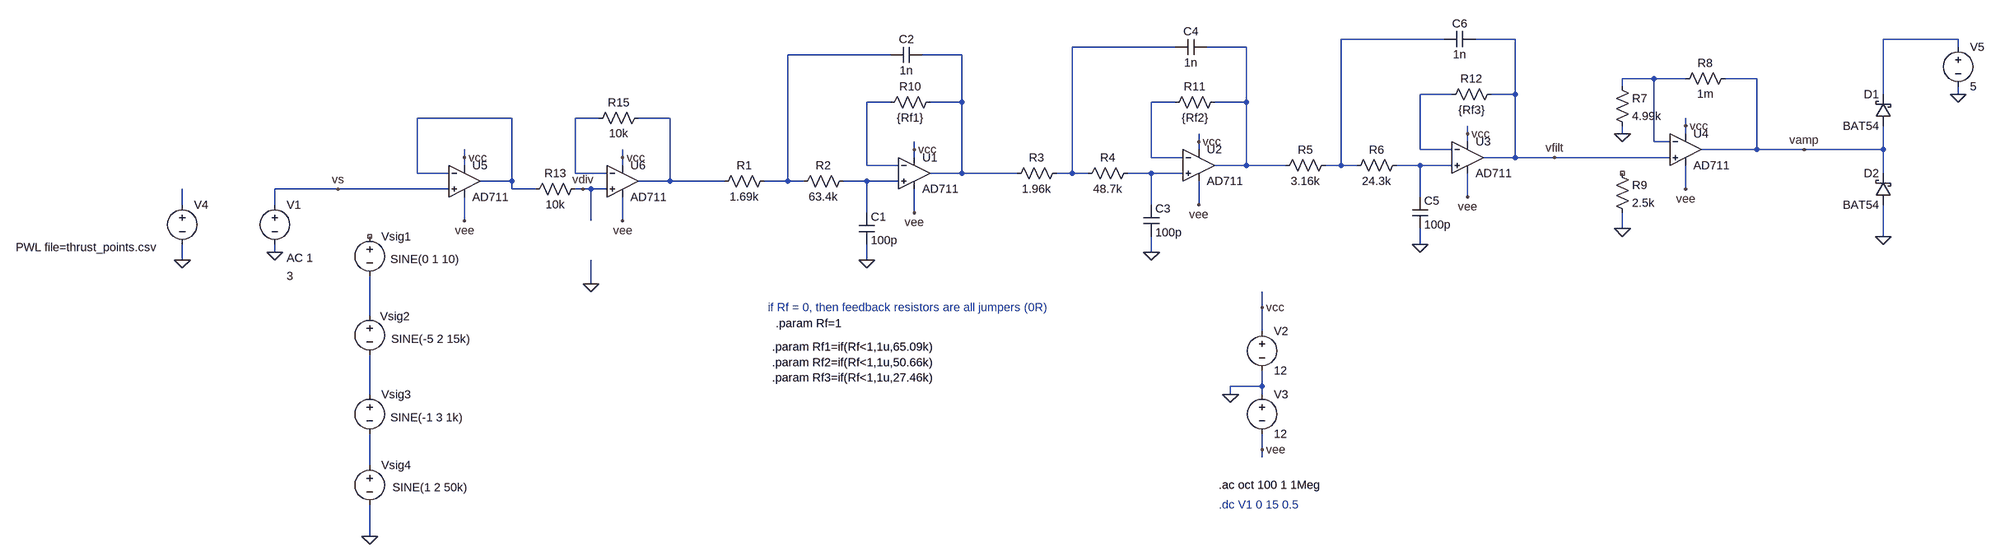
[diagram p0: schematic Anti-Aliasing Filter 30kHz 6th order Bessel.asc]
Anti-Aliasing Filter 30kHz 6th order Bessel.asc, the LTspice schematic file:
Version 4
SHEET 1 3004 744
WIRE 1616 -304 1408 -304
WIRE 1760 -304 1680 -304
WIRE 2912 -304 2752 -304
WIRE 1072 -288 864 -288
WIRE 1216 -288 1136 -288
WIRE 2912 -288 2912 -304
WIRE 496 -272 288 -272
WIRE 640 -272 560 -272
WIRE 2288 -224 2224 -224
WIRE 2352 -224 2288 -224
WIRE 2496 -224 2432 -224
WIRE 2224 -208 2224 -224
WIRE 1632 -192 1568 -192
WIRE 1760 -192 1760 -304
WIRE 1760 -192 1712 -192
WIRE 2752 -192 2752 -304
WIRE 2912 -192 2912 -208
WIRE 496 -176 448 -176
WIRE 640 -176 640 -272
WIRE 640 -176 576 -176
WIRE 1072 -176 1024 -176
WIRE 1216 -176 1216 -288
WIRE 1216 -176 1152 -176
WIRE -272 -144 -464 -144
WIRE -96 -144 -144 -144
WIRE 48 -144 -16 -144
WIRE 2352 -128 2352 -144
WIRE 1664 -112 1664 -128
WIRE 2224 -112 2224 -128
WIRE 2352 -112 2352 -128
WIRE 1120 -96 1120 -112
WIRE 1664 -96 1664 -112
WIRE 2288 -96 2288 -224
WIRE 2320 -96 2288 -96
WIRE 544 -80 544 -96
WIRE 1120 -80 1120 -96
WIRE 1568 -80 1568 -192
WIRE 1632 -80 1568 -80
WIRE 2496 -80 2496 -224
WIRE 2496 -80 2384 -80
WIRE 2592 -80 2496 -80
WIRE 2752 -80 2752 -128
WIRE 2752 -80 2592 -80
WIRE -368 -64 -368 -80
WIRE -48 -64 -48 -80
WIRE 544 -64 544 -80
WIRE 1024 -64 1024 -176
WIRE 1088 -64 1024 -64
WIRE 1760 -64 1760 -192
WIRE 1760 -64 1696 -64
WIRE 1840 -64 1760 -64
WIRE 2320 -64 1840 -64
WIRE -368 -48 -368 -64
WIRE -48 -48 -48 -64
WIRE 448 -48 448 -176
WIRE 512 -48 448 -48
WIRE 1216 -48 1216 -176
WIRE 1216 -48 1152 -48
WIRE 1296 -48 1216 -48
WIRE 1408 -48 1408 -304
WIRE 1408 -48 1376 -48
WIRE 1440 -48 1408 -48
WIRE 1568 -48 1520 -48
WIRE 1632 -48 1568 -48
WIRE -464 -32 -464 -144
WIRE -400 -32 -464 -32
WIRE -144 -32 -144 -144
WIRE -80 -32 -144 -32
WIRE 640 -32 640 -176
WIRE 640 -32 576 -32
WIRE 752 -32 640 -32
WIRE 864 -32 864 -288
WIRE 864 -32 832 -32
WIRE 896 -32 864 -32
WIRE 1024 -32 976 -32
WIRE 1088 -32 1024 -32
WIRE 2752 -32 2752 -80
WIRE -272 -16 -272 -144
WIRE -272 -16 -336 -16
WIRE 48 -16 48 -144
WIRE 48 -16 -16 -16
WIRE 160 -16 48 -16
WIRE 288 -16 288 -272
WIRE 288 -16 240 -16
WIRE 320 -16 288 -16
WIRE 448 -16 400 -16
WIRE 512 -16 448 -16
WIRE -624 0 -752 0
WIRE -400 0 -624 0
WIRE -272 0 -272 -16
WIRE -224 0 -272 0
WIRE -128 0 -144 0
WIRE -112 0 -128 0
WIRE -80 0 -112 0
WIRE 2352 0 2352 -48
WIRE 1568 16 1568 -48
WIRE 1664 16 1664 -32
WIRE -976 32 -976 0
WIRE -752 32 -752 0
WIRE 1024 32 1024 -32
WIRE 1120 32 1120 -16
WIRE 448 48 448 -16
WIRE 544 48 544 0
WIRE -368 64 -368 16
WIRE -112 64 -112 0
WIRE -48 64 -48 16
WIRE 2224 80 2224 48
WIRE 2752 96 2752 32
WIRE 1568 112 1568 80
WIRE -752 128 -752 112
WIRE 1024 128 1024 96
WIRE -976 144 -976 112
WIRE 448 144 448 112
WIRE -112 192 -112 144
WIRE 1248 240 1248 208
WIRE -560 256 -560 176
WIRE 1248 288 1248 240
WIRE 1248 400 1248 368
WIRE 1248 400 1184 400
WIRE -560 416 -560 336
WIRE 1184 416 1184 400
WIRE 1248 416 1248 400
WIRE 1248 528 1248 496
WIRE 1248 544 1248 528
WIRE -560 560 -560 496
WIRE -560 704 -560 640
FLAG -752 128 0
FLAG 448 144 0
FLAG 544 -80 vcc
FLAG 544 48 vee
FLAG 1184 416 0
FLAG 1248 240 vcc
FLAG 1248 528 vee
FLAG 1024 128 0
FLAG 1120 -96 vcc
FLAG 1120 32 vee
FLAG 1568 112 0
FLAG 1664 -112 vcc
FLAG 1664 16 vee
FLAG 1840 -64 vfilt
FLAG 2352 -128 vcc
FLAG 2352 0 vee
FLAG 2224 -112 0
FLAG 2592 -80 vamp
FLAG -560 704 0
FLAG 2224 80 0
FLAG -976 144 0
FLAG -368 -64 vcc
FLAG -368 64 vee
FLAG 2752 96 0
FLAG 2912 -192 0
FLAG -48 -64 vcc
FLAG -48 64 vee
FLAG -112 192 0
FLAG -624 0 vs
FLAG -128 0 vdiv
SYMBOL voltage -752 16 R0
WINDOW 123 24 124 Left 2
WINDOW 39 0 0 Left 0
WINDOW 3 24 160 Left 2
SYMATTR Value2 AC 1
SYMATTR Value 3
SYMATTR InstName V1
SYMBOL res 256 -32 R90
WINDOW 0 0 56 VBottom 2
WINDOW 3 32 56 VTop 2
SYMATTR InstName R1
SYMATTR Value 1.69k
SYMBOL res 416 -32 R90
WINDOW 0 0 56 VBottom 2
WINDOW 3 32 56 VTop 2
SYMATTR InstName R2
SYMATTR Value 63.4k
SYMBOL cap 432 48 R0
SYMATTR InstName C1
SYMATTR Value 100p
SYMBOL cap 560 -288 R90
WINDOW 0 0 32 VBottom 2
WINDOW 3 32 32 VTop 2
SYMATTR InstName C2
SYMATTR Value 1n
SYMBOL OpAmps\\AD711 544 -96 R0
SYMATTR InstName U1
SYMBOL voltage 1248 272 R0
WINDOW 123 0 0 Left 0
WINDOW 39 0 0 Left 0
SYMATTR InstName V2
SYMATTR Value 12
SYMBOL voltage 1248 400 R0
WINDOW 123 0 0 Left 0
WINDOW 39 0 0 Left 0
SYMATTR InstName V3
SYMATTR Value 12
SYMBOL res 848 -48 R90
WINDOW 0 0 56 VBottom 2
WINDOW 3 32 56 VTop 2
SYMATTR InstName R3
SYMATTR Value 1.96k
SYMBOL res 992 -48 R90
WINDOW 0 0 56 VBottom 2
WINDOW 3 32 56 VTop 2
SYMATTR InstName R4
SYMATTR Value 48.7k
SYMBOL cap 1008 32 R0
SYMATTR InstName C3
SYMATTR Value 100p
SYMBOL cap 1136 -304 R90
WINDOW 0 0 32 VBottom 2
WINDOW 3 32 32 VTop 2
SYMATTR InstName C4
SYMATTR Value 1n
SYMBOL OpAmps\\AD711 1120 -112 R0
SYMATTR InstName U2
SYMBOL res 1392 -64 R90
WINDOW 0 0 56 VBottom 2
WINDOW 3 32 56 VTop 2
SYMATTR InstName R5
SYMATTR Value 3.16k
SYMBOL res 1536 -64 R90
WINDOW 0 0 56 VBottom 2
WINDOW 3 32 56 VTop 2
SYMATTR InstName R6
SYMATTR Value 24.3k
SYMBOL cap 1552 16 R0
SYMATTR InstName C5
SYMATTR Value 100p
SYMBOL cap 1680 -320 R90
WINDOW 0 0 32 VBottom 2
WINDOW 3 32 32 VTop 2
SYMATTR InstName C6
SYMATTR Value 1n
SYMBOL OpAmps\\AD711 1664 -128 R0
SYMATTR InstName U3
SYMBOL OpAmps\\AD711 2352 -144 R0
SYMATTR InstName U4
SYMBOL res 2208 -224 R0
SYMATTR InstName R7
SYMATTR Value 4.99k
SYMBOL res 2448 -240 R90
WINDOW 0 0 56 VBottom 2
WINDOW 3 32 56 VTop 2
SYMATTR InstName R8
SYMATTR Value 1m
SYMBOL voltage -560 80 R0
WINDOW 3 42 62 Left 2
WINDOW 123 24 124 Left 2
WINDOW 39 0 0 Left 0
SYMATTR Value SINE(0 1 10)
SYMATTR InstName Vsig1
SYMBOL voltage -560 240 R0
WINDOW 3 44 64 Left 2
WINDOW 123 24 124 Left 2
WINDOW 39 0 0 Left 0
WINDOW 0 21 18 Left 2
SYMATTR Value SINE(-5 2 15k)
SYMATTR InstName Vsig2
SYMBOL voltage -560 400 R0
WINDOW 3 42 63 Left 2
WINDOW 123 24 124 Left 2
WINDOW 39 0 0 Left 0
SYMATTR Value SINE(-1 3 1k)
SYMATTR InstName Vsig3
SYMBOL voltage -560 544 R0
WINDOW 3 46 61 Left 2
WINDOW 123 24 124 Left 2
WINDOW 39 0 0 Left 0
SYMATTR Value SINE(1 2 50k)
SYMATTR InstName Vsig4
SYMBOL res 2208 -48 R0
SYMATTR InstName R9
SYMATTR Value 2.5k
SYMBOL voltage -976 16 R0
WINDOW 123 0 0 Left 0
WINDOW 39 0 0 Left 0
WINDOW 3 -337 102 Left 2
SYMATTR Value PWL file=thrust_points.csv
SYMATTR InstName V4
SYMBOL OpAmps\\AD711 -368 -80 R0
SYMATTR InstName U5
SYMBOL res 1168 -192 R90
WINDOW 0 0 56 VBottom 2
WINDOW 3 32 56 VTop 2
SYMATTR InstName R11
SYMATTR Value {Rf2}
SYMBOL res 1728 -208 R90
WINDOW 0 0 56 VBottom 2
WINDOW 3 32 56 VTop 2
SYMATTR InstName R12
SYMATTR Value {Rf3}
SYMBOL res 592 -192 R90
WINDOW 0 0 56 VBottom 2
WINDOW 3 32 56 VTop 2
SYMATTR InstName R10
SYMATTR Value {Rf1}
SYMBOL schottky 2768 -128 R180
WINDOW 0 24 64 Left 2
WINDOW 3 24 0 Left 2
SYMATTR InstName D1
SYMATTR Value BAT54
SYMATTR Description Diode
SYMATTR Type diode
SYMBOL schottky 2768 32 R180
WINDOW 0 24 64 Left 2
WINDOW 3 24 0 Left 2
SYMATTR InstName D2
SYMATTR Value BAT54
SYMATTR Description Diode
SYMATTR Type diode
SYMBOL voltage 2912 -304 R0
WINDOW 123 0 0 Left 0
WINDOW 39 0 0 Left 0
SYMATTR InstName V5
SYMATTR Value 5
SYMBOL OpAmps\\AD711 -48 -80 R0
SYMATTR InstName U6
SYMBOL res -128 -16 R90
WINDOW 0 0 56 VBottom 2
WINDOW 3 32 56 VTop 2
SYMATTR InstName R13
SYMATTR Value 10k
SYMBOL res 0 -160 R90
WINDOW 0 0 56 VBottom 2
WINDOW 3 32 56 VTop 2
SYMATTR InstName R15
SYMATTR Value 10k
TEXT 1160 600 Left 2 !.ac oct 100 1 1Meg
TEXT 1160 640 Left 2 ;.dc V1 0 15 0.5
TEXT 264 272 Left 2 !.param Rf=1
TEXT 248 240 Left 2 ;if Rf = 0, then feedback resistors are all jumpers (0R)
TEXT 256 320 Left 2 !.param Rf1=if(Rf<1,1u,65.09k)\n.param Rf2=if(Rf<1,1u,50.66k)\n.param Rf3=if(Rf<1,1u,27.46k)

The netlist it stands for:
* Anti-Aliasing Filter 30kHz 6th order Bessel.asc
V1 vs 0 3 AC 1
R1 N005 N013 1.69k
R2 N016 N005 63.4k
C1 N016 0 100p
C2 N006 N005 1n
XU1 N016 N009 vcc vee N006 AD712  ; AD711, pins In+ In- V+ V- OUT
V2 vcc 0 12
V3 0 vee 12
R3 N003 N006 1.96k
R4 N015 N003 48.7k
C3 N015 0 100p
C4 N004 N003 1n
XU2 N015 N010 vcc vee N004 AD712  ; AD711, pins In+ In- V+ V- OUT
R5 N001 N004 3.16k
R6 N014 N001 24.3k
C5 N014 0 100p
C6 vfilt N001 1n
XU3 N014 N008 vcc vee vfilt AD712  ; AD711, pins In+ In- V+ V- OUT
XU4 vfilt N007 vcc vee vamp AD712  ; AD711, pins In+ In- V+ V- OUT
R7 N007 0 4.99k
R8 vamp N007 1m
Vsig1 NC_01 N018 SINE(0 1 10)
Vsig2 N018 N019 SINE(-5 2 15k)
Vsig3 N019 N020 SINE(-1 3 1k)
Vsig4 N020 0 SINE(1 2 50k)
R9 NC_02 0 2.5k
V4 N017 0 PWL file=thrust_points.csv
XU5 vs N011 vcc vee N011 AD712  ; AD711, pins In+ In- V+ V- OUT
R11 N004 N010 {Rf2}
R12 vfilt N008 {Rf3}
R10 N006 N009 {Rf1}
D1 vamp N002 BAT54
D2 0 vamp BAT54
V5 N002 0 5
XU6 vdiv N012 vcc vee N013 AD712  ; AD711, pins In+ In- V+ V- OUT
R13 vdiv N011 10k
R15 N013 N012 10k
.model D D
.lib standard.dio
.ac oct 100 1 1Meg
* .dc V1 0 15 0.5
.param Rf=1
* if Rf = 0, then feedback resistors are all jumpers (0R)
.param Rf1=if(Rf<1,1u,65.09k)
.param Rf2=if(Rf<1,1u,50.66k)
.param Rf3=if(Rf<1,1u,27.46k)
.lib ADI1.lib
.backanno
.end